# EAGLE design WFT0420CZ15_eval (EAGLE 7.5.0)
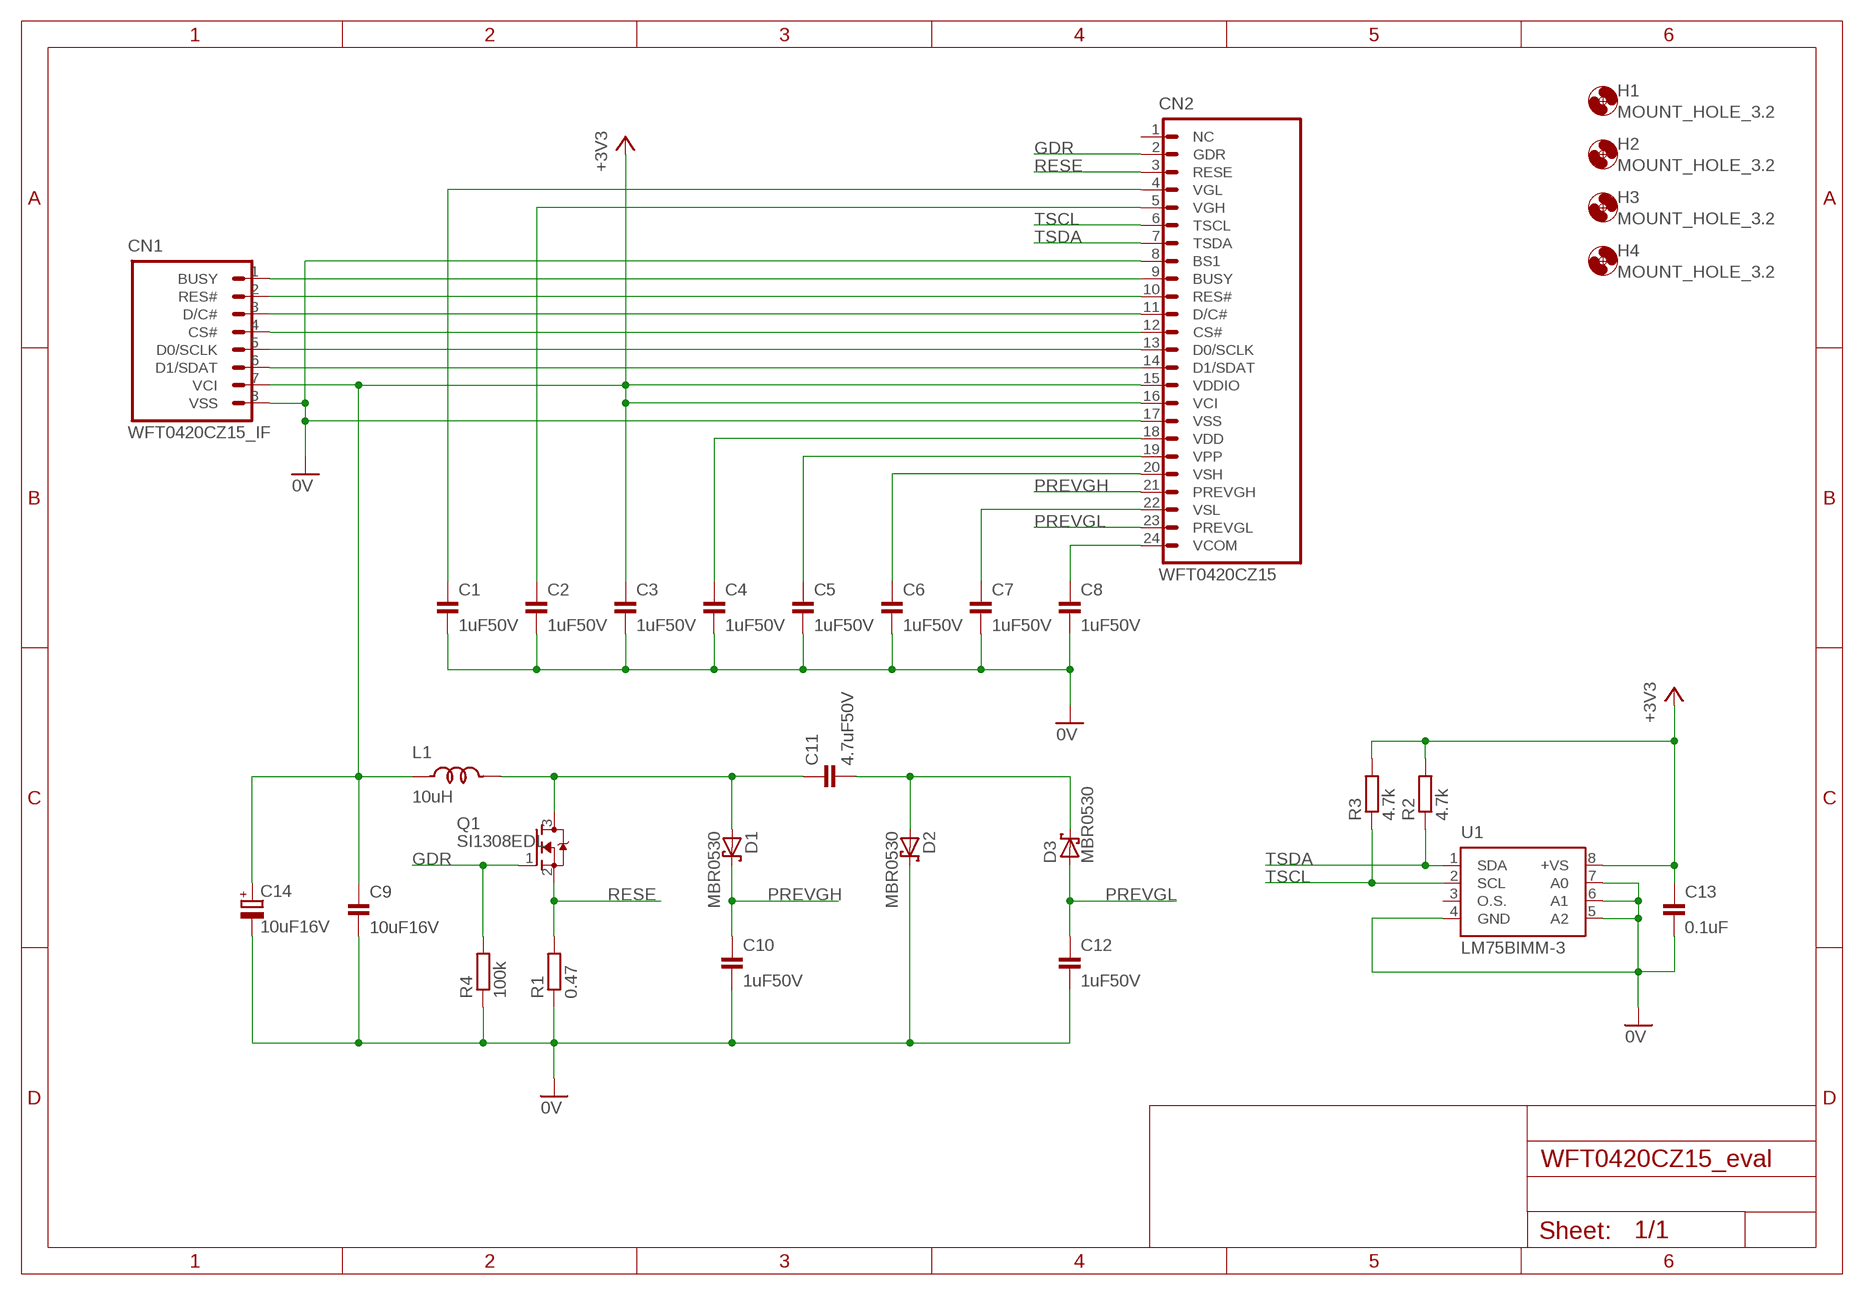
[diagram p0: schematic, sheet 1]

## Parts
C1  1uF50V  CAP_0805  [SMD_2012]
C2  1uF50V  CAP_0805  [SMD_2012]
C3  1uF50V  CAP_0805  [SMD_2012]
C4  1uF50V  CAP_0805  [SMD_2012]
C5  1uF50V  CAP_0805  [SMD_2012]
C6  1uF50V  CAP_0805  [SMD_2012]
C7  1uF50V  CAP_0805  [SMD_2012]
C8  1uF50V  CAP_0805  [SMD_2012]
C9  10uF16V  CAP_0805  [SMD_2012]
C10  1uF50V  CAP_0805  [SMD_2012]
C11  4.7uF50V  CAP_0805  [SMD_2012]
C12  1uF50V  CAP_0805  [SMD_2012]
C13  0.1uF  CAP_0805  [SMD_2012]
C14  10uF16V  TPST106K016R0800  [C1210]
CN1  WFT0420CZ15_IF  [WFT0420CZ15_IF_8PIN]
CN2  WFT0420CZ15  [FCB05-24P-REVERSE]
D1  MBR0530  [MBR0530]
D2  MBR0530  [MBR0530]
D3  MBR0530  [MBR0530]
H1  MOUNT_HOLE_3.2  [3,2]
H2  MOUNT_HOLE_3.2  [3,2]
H3  MOUNT_HOLE_3.2  [3,2]
H4  MOUNT_HOLE_3.2  [3,2]
L1  10uH  NLCV25T  [NLCV25T]
Q1  SI1308EDL  [SOT323]
R1  0.47  RESISTOR_0805  [SMD_2012]
R2  4.7k  RESISTOR_0805  [SMD_2012]
R3  4.7k  RESISTOR_0805  [SMD_2012]
R4  100k  RESISTOR_0805  [SMD_2012]
U1  LM75BIMM-3  [SSOP8-DGK]

## Nets
0V: C1.2 C2.2 C3.2 C4.2 C5.2 C6.2 C7.2 C8.2 C9.2 C10.2 C12.2 C13.2 C14.2(-) CN1.8(VSS) CN2.8(BS1) CN2.17(VSS) D2.1(C) R1.1 R4.1 U1.4(GND) U1.5(A2) U1.6(A1) U1.7(A0)
+3V3: C3.1 C9.1 C13.1 C14.1(+) CN1.7(VCI) CN2.15(VDDIO) CN2.16(VCI) L1.1 R2.2 R3.2 U1.8(+VS)
GDR: CN2.2(GDR) Q1.1(G) R4.2
N$1: C8.1 CN2.24(VCOM)
N$2: C7.1 CN2.22(VSL)
N$3: C6.1 CN2.20(VSH)
N$4: C5.1 CN2.19(VPP)
N$5: C4.1 CN2.18(VDD)
N$6: C11.1 D1.2(A) L1.2 Q1.3(D)
N$7: C2.1 CN2.5(VGH)
N$8: C1.1 CN2.4(VGL)
N$9: CN1.1(BUSY) CN2.9(BUSY)
N$10: CN1.2(RES#) CN2.10(RES#)
N$11: CN1.3(D/C#) CN2.11(D/C#)
N$12: CN1.4(CS#) CN2.12(CS#)
N$13: CN1.5(D0/SCLK) CN2.13(D0/SCLK)
N$14: CN1.6(D1/SDAT) CN2.14(D1/SDAT)
N$15: C11.2 D2.2(A) D3.1(C)
PREVGH: C10.1 CN2.21(PREVGH) D1.1(C)
PREVGL: C12.1 CN2.23(PREVGL) D3.2(A)
RESE: CN2.3(RESE) Q1.2(S) R1.2
TSCL: CN2.6(TSCL) R3.1 U1.2(SCL)
TSDA: CN2.7(TSDA) R2.1 U1.1(SDA)
Unconnected: CN2.1(NC) U1.3(O.S.)

## Library data of the parts
C1-C13 = Parts:CAP: コンデンサー
C14 = Parts:TPST*: タンタルコンデンサ TPST106K016R0800 10µF ±10% 16V ESR（等価直列抵抗）: 0.8オーム 動作温度 : -55°C～125°C サイズ : 3.50mm x 2.80mm
CN1 = PartsForProto:WFT0420CZ15_IF: WF0420CZ15変換基板用I/F
CN2 = PartsForProto:WFT0420CZ15: インターフェースピン
D1-D3 = Parts:MBR0530: ショットキーダイオード
H1-H4 = Generic:MOUNT_HOLE
L1 = Parts:NLCV*: LEAD INDUCTOR
Q1 = Parts:SI1308EDL: N-Channel 30 V (D-S) MOSFET
R1-R4 = Parts:RESISTOR: 抵抗器
U1 = Parts:LM75B*: 基板取付型温度センサー

## Board
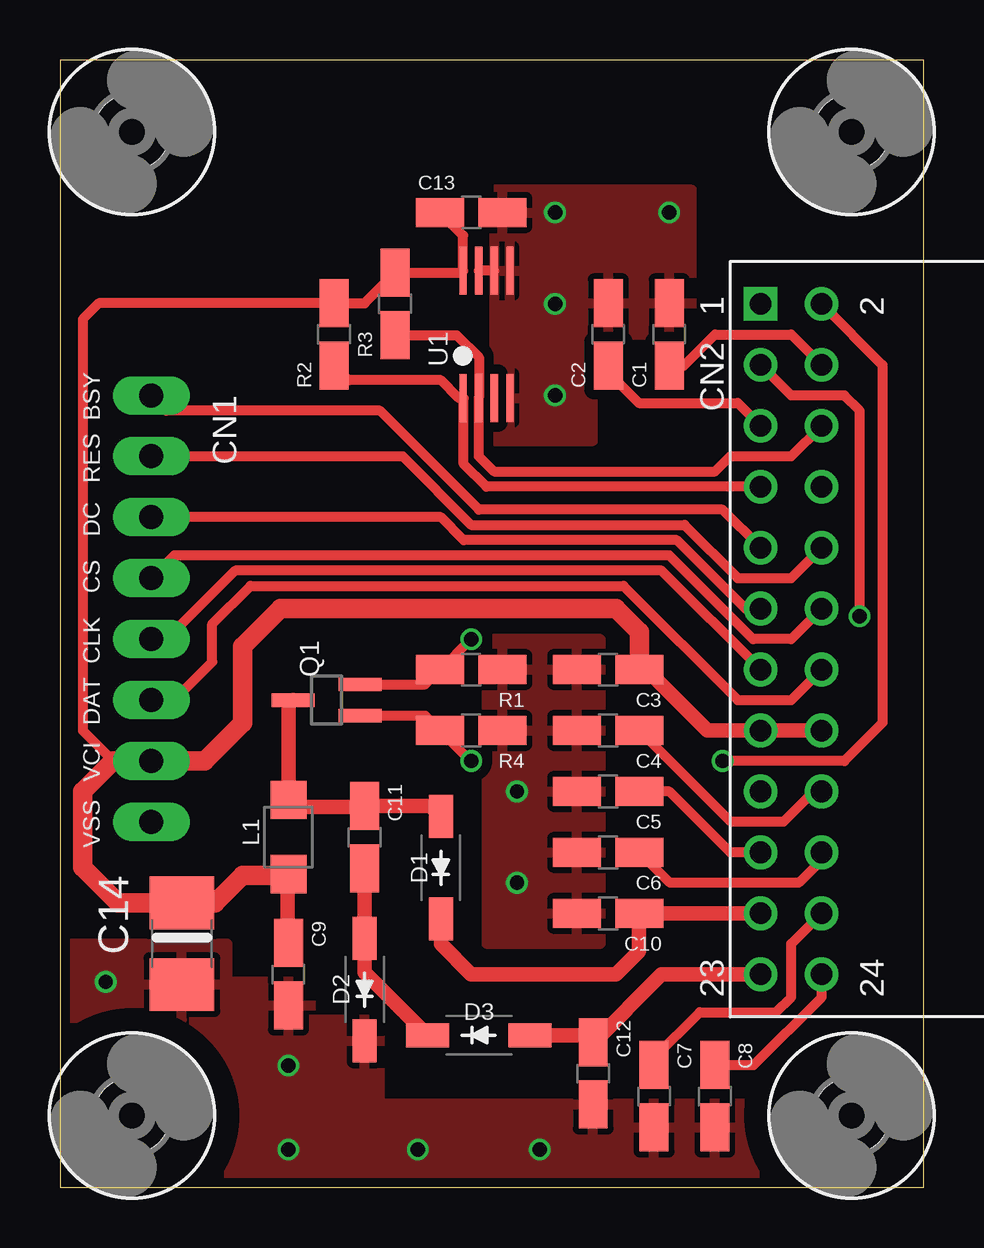
[diagram p1: board, top side]
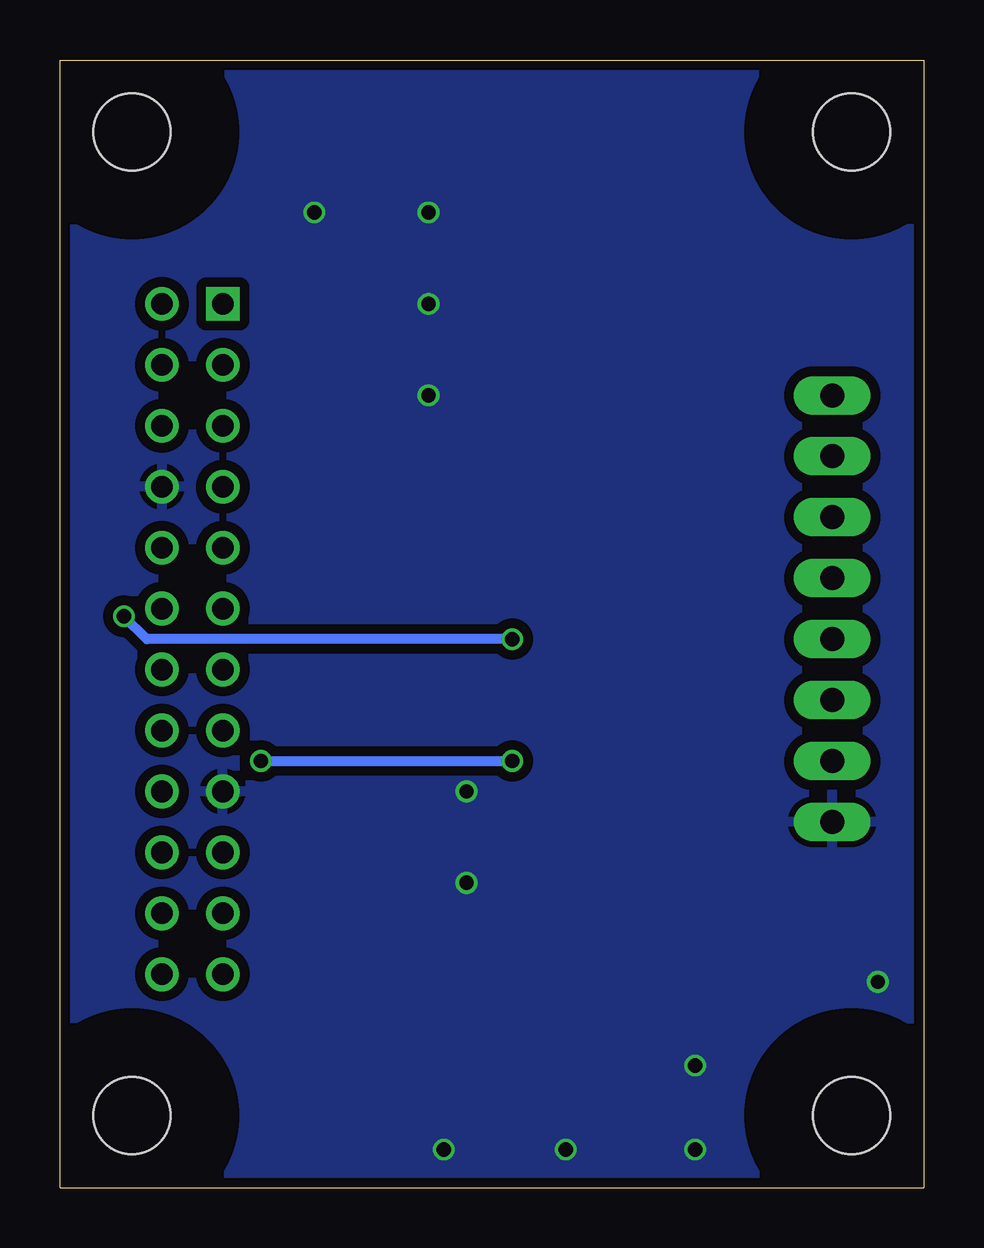
[diagram p2: board, bottom side, seen from below]

Size 36 x 47 mm. Coordinates in mm from the lower left corner, seen from the top.
Outline: 36,0 36,47 0,47 0,0 36,0
Copper layers (1*16): Top 0.035mm / dielectric 1.5mm / Bottom 0.035mm
Design rules "SeeedStudio_2layer_DRU_no_angle_20140221": minimum track width 6mil, minimum drill 12mil, track to track 6mil, track to pad 6mil, pad to pad 6mil, via to via 6mil, smd to smd 0mil, copper to edge 10mil, drill to drill 10mil, minimum pad ring 10mil, minimum via ring 6mil, stop-mask expansion 2mil, vias tented up to drill 100mil, thermal gap 10mil

### Footprints (pad centres in the part's own frame; a part is rotated, then mirrored left to right if it is on the bottom)
SMD_2012 = smd 2 x 1.2: 1 -1.3,0; 2 1.3,0
C1210 = smd 2.2 x 2.7: 1 -1.7,0; 2 1.7,0
WFT0420CZ15_IF_8PIN = drill 1 pad 1.6 long: 1 0,0; 2 2.54,0; 3 5.08,0; 4 7.62,0; 5 10.16,0; 6 12.7,0; 7 15.24,0; 8 17.78,0
FCB05-24P-REVERSE = drill 0.9 square: 1 0,0 | drill 0.9: 2 0,2.54; 3 2.54,0; 4 2.54,2.54; 5 5.08,0; 6 5.08,2.54; 7 7.62,0; 8 7.62,2.54; 9 10.16,0; 10 10.16,2.54; 11 12.7,0; 12 12.7,2.54; 13 15.24,0; 14 15.24,2.54; 15 17.78,0; 16 17.78,2.54; 17 20.32,0; 18 20.32,2.54; 19 22.86,0; 20 22.86,2.54; 21 25.4,0; 22 25.4,2.54; 23 27.94,0; 24 27.94,2.54
MBR0530 = smd 1.8 x 1: 1 -2.135,0; 2 2.135,0
3,2 = hole 3.2: 0,0
NLCV25T = smd 1.6 x 1.5: 1 -1.55,0; 2 1.55,0
SOT323 = smd 0.56 x 1.8: 1 -0.65,-1.4; 2 0.65,-1.4; 3 0,1.4
SSOP8-DGK = smd 0.3 x 2: 1 -0.975,-2.65; 2 -0.325,-2.65; 3 0.325,-2.65; 4 0.975,-2.65; 5 0.975,2.65; 6 0.325,2.65; 7 -0.325,2.65; 8 -0.975,2.65

### Placement (x,y rotation side)
C1  25.4,35.56 90 top
C2  22.86,35.56 90 top
C3  22.86,21.59 180 top
C4  22.86,19.05 180 top
C5  22.86,16.51 180 top
C6  22.86,13.97 180 top
C7  24.77,3.81 270 top
C8  27.3,3.81 270 top
C9  9.53,8.89 270 top
C10  22.86,11.43 180 top
C11  12.7,14.61 270 top
C12  22.23,4.76 270 top
C13  17.14,40.64 0 top
C14  5.08,10.16 270 top
CN1  3.81,33.02 270 top
CN2  29.21,36.83 270 top
D1  15.88,13.34 90 top
D2  12.7,8.26 90 top
D3  17.46,6.35 0 top
H1  33,3 0 top
H2  3,3 0 top
H3  33,44 0 top
H4  3,44 0 top
L1  9.53,14.61 90 top
Q1  11.11,20.32 90 top
R1  17.14,21.59 180 top
R2  11.43,35.56 90 top
R3  13.97,36.83 90 top
R4  17.14,19.05 180 top
U1  17.78,35.56 0 top

### Tracks (layer width: path | path; a pad name or v marks a point on that pad's centre or on a via)
0V  (via drill 0.6)
  Top 0.406: U1.6 U1.7
  other vias: 19.05,16.51 20,1.59 9.53,5.08 9.53,1.59 25.4,40.64 20.64,36.83 20.64,33.02 20.64,40.64 19.05,12.7 1.91,8.57 14.92,1.59
  pour Bottom (isolate 0.406, rank 3): -2.54,49.53 37.47,49.53 37.78,-2.86 -2.54,-3.17
  pour Top (isolate 0.406, rank 3): -1.27,-1.27 36.83,-1.27 36.83,3.49 13.34,3.49 13.34,6.99 10.48,6.99 10.48,8.57 6.99,8.57 6.99,10.16 -1.27,10.16
  pour Top (isolate 0.406, rank 3): 26.35,41.59 18.1,41.59 18.1,31.11 22.23,31.11 22.23,35.56 26.35,35.56
  pour Top (isolate 0.406, rank 3): 17.78,10.16 22.54,10.16 22.54,22.86 17.78,22.86
+3V3
  Top 0.406: 2.22,17.78 0.95,19.05 0.95,36.2 1.62,36.86 R2.2 12.7,36.86 R3.2 16.73,38.13 U1.8 16.8,39.68 C13.1
  Top 0.61: CN2.16 CN2.15 26.99,19.05 24.77,21.27 24.48,21.27 C3.1 | 9.49,13.02 9.49,10.23 C9.1
  Top 0.813: L1.1 9.49,13.02 7.62,13.02 6.46,11.86 C14.1 2.43,11.86 0.95,13.34 0.95,16.51 2.22,17.78 CN1.7 6.03,17.78 7.62,19.37 7.62,22.54 9.21,24.13 23.18,24.13 24.16,23.15 C3.1
GDR  (via drill 0.6)
  Top 0.406: Q1.1 15.22,19.67 R4.2 17.11,17.78 v17.14,17.78 | CN2.2 34.29,34.29 34.29,19.37 32.7,17.78 v27.62,17.78
  Bottom 0.406: v27.62,17.78 v17.14,17.78
N$1
  Top 0.406: C8.1 28.92,5.11 31.75,7.94 CN2.24
N$2
  Top 0.406: C7.1 24.77,5.4 26.67,7.3 29.84,7.3 30.48,7.94 30.48,10.16 CN2.22
N$3
  Top 0.406: CN2.20 31.75,13.65 30.8,12.7 25.43,12.7 C6.1
N$4
  Top 0.406: CN2.19 27.94,13.97 25.4,16.51 C5.1
N$5
  Top 0.406: CN2.18 31.43,16.51 30.16,15.24 27.97,15.24 C4.1
N$6
  Top 0.61: Q1.3 9.53,20.13 L1.2 9.56,16.16 9.84,15.88 12.67,15.88 C11.1 15.44,15.9 D1.2
N$7
  Top 0.406: C2.1 22.86,33.97 24.13,32.7 28.26,32.7 CN2.5
N$8
  Top 0.406: C1.1 26,34.26 27.3,35.56 30.48,35.56 CN2.4
N$9
  Top 0.406: CN2.9 27.62,28.26 17.46,28.26 13.34,32.38 4.45,32.38 CN1.1
N$10
  Top 0.406: CN1.2 14.29,30.48 17.14,27.62 26.04,27.62 28.26,25.4 30.48,25.4 CN2.10
N$11
  Top 0.406: CN2.11 28.57,24.13 25.72,26.99 16.83,26.99 15.88,27.94 CN1.3
N$12
  Top 0.406: CN2.12 30.48,22.86 28.89,22.86 25.4,26.35 4.76,26.35 CN1.4
N$13
  Top 0.406: CN2.13 25.08,25.72 7.3,25.72 4.45,22.86 CN1.5
N$14
  Top 0.406: CN1.6 4.76,20.32 6.35,21.91 6.35,23.5 7.94,25.08 23.5,25.08 28.26,20.32 30.48,20.32 CN2.14
N$15
  Top 0.61: C11.2 D2.2 12.7,8.98 D3.1
PREVGH
  Top 0.61: D1.1 15.88,10.16 17.14,8.89 23.18,8.89 24.13,9.84 24.13,11.4 C10.1 CN2.21
PREVGL
  Top 0.61: D3.2 21.94,6.35 C12.1 22.25,6.06 25.08,8.89 CN2.23
RESE  (via drill 0.6)
  Top 0.406: Q1.2 15.22,20.97 R1.2 15.88,21.59 v17.14,22.86 | v33.34,23.81 33.34,32.38 32.7,33.02 30.48,33.02 CN2.3
  Bottom 0.406: v17.14,22.86 32.38,22.86 v33.34,23.81
TSCL
  Top 0.406: CN2.6 30.48,30.48 27.94,30.48 27.3,29.84 18.1,29.84 17.45,30.49 U1.2 17.46,34.61 16.54,35.53 R3.1
TSDA
  Top 0.406: CN2.7 17.78,29.21 16.83,30.16 16.83,32.89 U1.1 16.62,32.91 15.88,33.66 12.04,33.66 R2.1